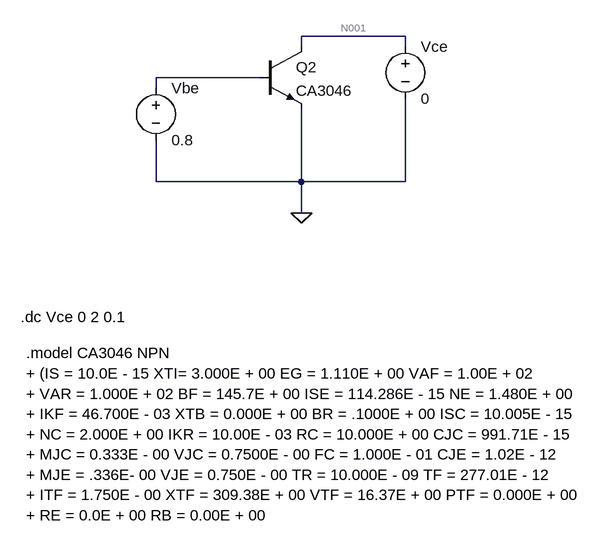
[diagram p0: schematic D1.asc]
D1.asc, the LTspice schematic file:
Version 4.1
SHEET 1 880 792
WIRE 352 64 192 64
WIRE 192 80 192 64
WIRE 352 80 352 64
WIRE 128 128 -32 128
WIRE -32 144 -32 128
WIRE -32 288 -32 224
WIRE 192 288 192 176
WIRE 192 288 -32 288
WIRE 352 288 352 160
WIRE 352 288 192 288
WIRE 192 336 192 288
FLAG 192 336 0
SYMBOL voltage -32 128 R0
SYMATTR InstName Vbe
SYMATTR Value 0.8
SYMBOL voltage 352 64 R0
SYMATTR InstName Vce
SYMATTR Value 0
SYMBOL npn 128 80 R0
SYMATTR InstName Q2
SYMATTR Value CA3046
TEXT -232 552 Left 2 !.model CA3046 NPN\n+ (IS = 10.0E - 15 XTI= 3.000E + 00 EG = 1.110E + 00 VAF = 1.00E + 02\n+ VAR = 1.000E + 02 BF = 145.7E + 00 ISE = 114.286E - 15 NE = 1.480E + 00\n+ IKF = 46.700E - 03 XTB = 0.000E + 00 BR = .1000E + 00 ISC = 10.005E - 15\n+ NC = 2.000E + 00 IKR = 10.00E - 03 RC = 10.000E + 00 CJC = 991.71E - 15\n+ MJC = 0.333E - 00 VJC = 0.7500E - 00 FC = 1.000E - 01 CJE = 1.02E - 12\n+ MJE = .336E- 00 VJE = 0.750E - 00 TR = 10.000E - 09 TF = 277.01E - 12\n+ ITF = 1.750E - 00 XTF = 309.38E + 00 VTF = 16.37E + 00 PTF = 0.000E + 00\n+ RE = 0.0E + 00 RB = 0.00E + 00
TEXT -240 496 Left 2 !.dc Vce 0 2 0.1

The netlist it stands for:
* D1.asc
Vbe N002 0 0.8
Vce N001 0 0
Q2 N001 N002 0 0 CA3046
.model NPN NPN
.model PNP PNP
.lib standard.bjt
.model CA3046 NPN
+ (IS = 10.0E - 15 XTI= 3.000E + 00 EG = 1.110E + 00 VAF = 1.00E + 02
+ VAR = 1.000E + 02 BF = 145.7E + 00 ISE = 114.286E - 15 NE = 1.480E + 00
+ IKF = 46.700E - 03 XTB = 0.000E + 00 BR = .1000E + 00 ISC = 10.005E - 15
+ NC = 2.000E + 00 IKR = 10.00E - 03 RC = 10.000E + 00 CJC = 991.71E - 15
+ MJC = 0.333E - 00 VJC = 0.7500E - 00 FC = 1.000E - 01 CJE = 1.02E - 12
+ MJE = .336E- 00 VJE = 0.750E - 00 TR = 10.000E - 09 TF = 277.01E - 12
+ ITF = 1.750E - 00 XTF = 309.38E + 00 VTF = 16.37E + 00 PTF = 0.000E + 00
+ RE = 0.0E + 00 RB = 0.00E + 00
.dc Vce 0 2 0.1
.backanno
.end

* Results of the author's LTspice run, read from the files saved beside the schematic
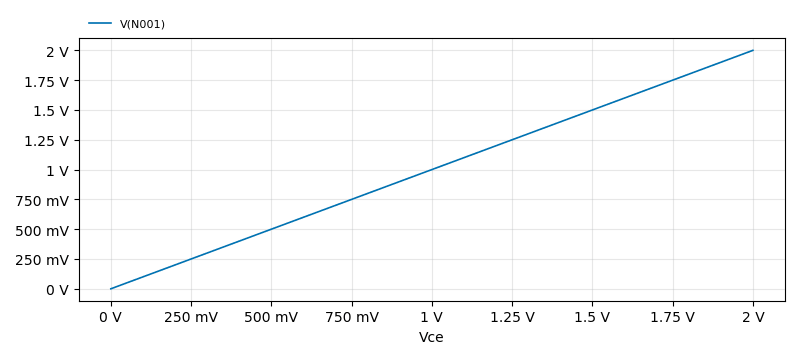
[diagram p1: DC transfer characteristic of D1.asc, plotted from the saved traces]
* DC transfer characteristic, 1 run:
*   V(N001): 0 V at Vce=0 V, 2 V at Vce=2 V, min 0 V, max 2 V